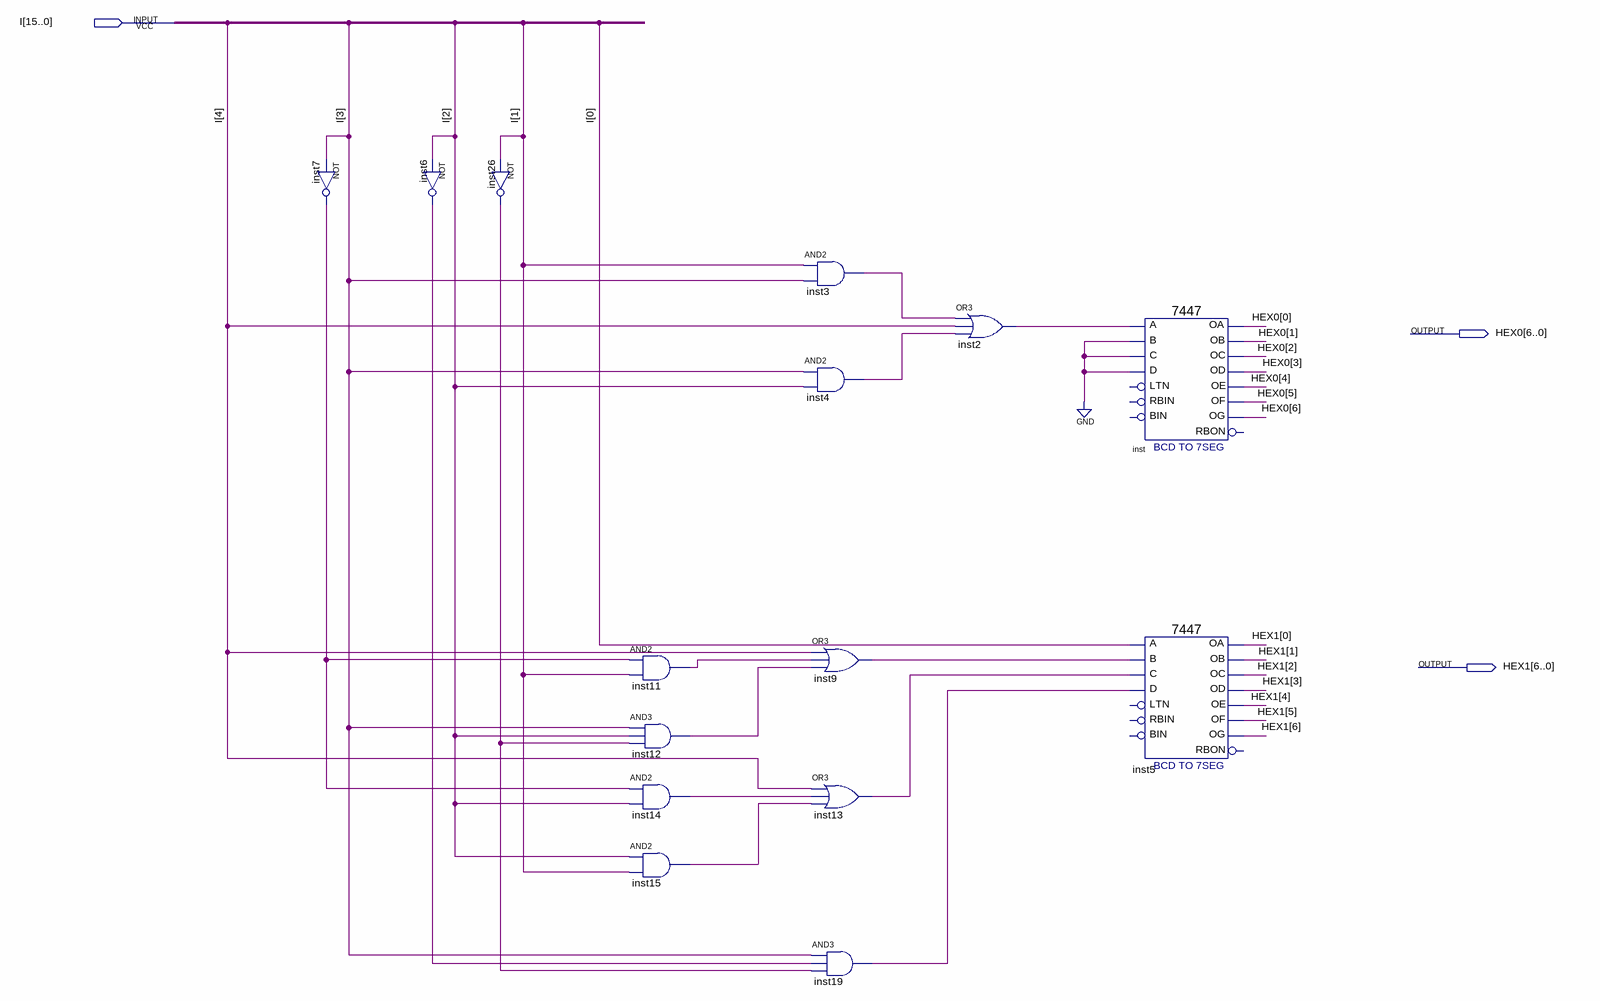
[diagram p0: schematic sheet]
// Quartus schematic decode7seg.bdf as structural Verilog: 15 symbols, 3 pins
module decode7seg (
  input  [15:0] I,
  output [6:0] HEX0,
  output [6:0] HEX1
);

  wire inst2_out, inst3_out, inst4_out, inst6_out, inst7_out, inst9_out, inst11_out, inst12_out, inst13_out,
       inst14_out, inst15_out, inst19_out, inst26_out;

  not inst7 (inst7_out, I[3]);
  not inst6 (inst6_out, I[2]);
  not inst26 (inst26_out, I[1]);
  and inst11 (inst11_out, inst7_out, I[1]);
  and inst12 (inst12_out, I[3], I[2], inst26_out);
  and inst14 (inst14_out, inst7_out, I[2]);
  and inst15 (inst15_out, I[2], I[1]);
  and inst3 (inst3_out, I[1], I[3]);
  and inst4 (inst4_out, I[3], I[2]);
  or inst9 (inst9_out, I[4], inst11_out, inst12_out);
  or inst13 (inst13_out, I[4], inst14_out, inst15_out);
  and inst19 (inst19_out, I[3], inst6_out, inst26_out);
  or inst2 (inst2_out, inst3_out, I[4], inst4_out);
  \7447  inst (
    .B(1'b0), .C(1'b0), .D(1'b0), .A(inst2_out), .OB(HEX0[1]), .OC(HEX0[2]), .OE(HEX0[4]), .OD(HEX0[3]),
    .OF(HEX0[5]), .OG(HEX0[6]), .OA(HEX0[0]));  // open: LTN, RBIN, BIN, RBON
  \7447  inst5 (
    .B(inst9_out), .C(inst13_out), .D(inst19_out), .A(I[0]), .OB(HEX1[1]), .OC(HEX1[2]), .OE(HEX1[4]),
    .OD(HEX1[3]), .OF(HEX1[5]), .OG(HEX1[6]), .OA(HEX1[0]));  // open: LTN, RBIN, BIN, RBON
endmodule
